# Altium schematic sheet Mouse_Send_SCH.SchDoc
size A3
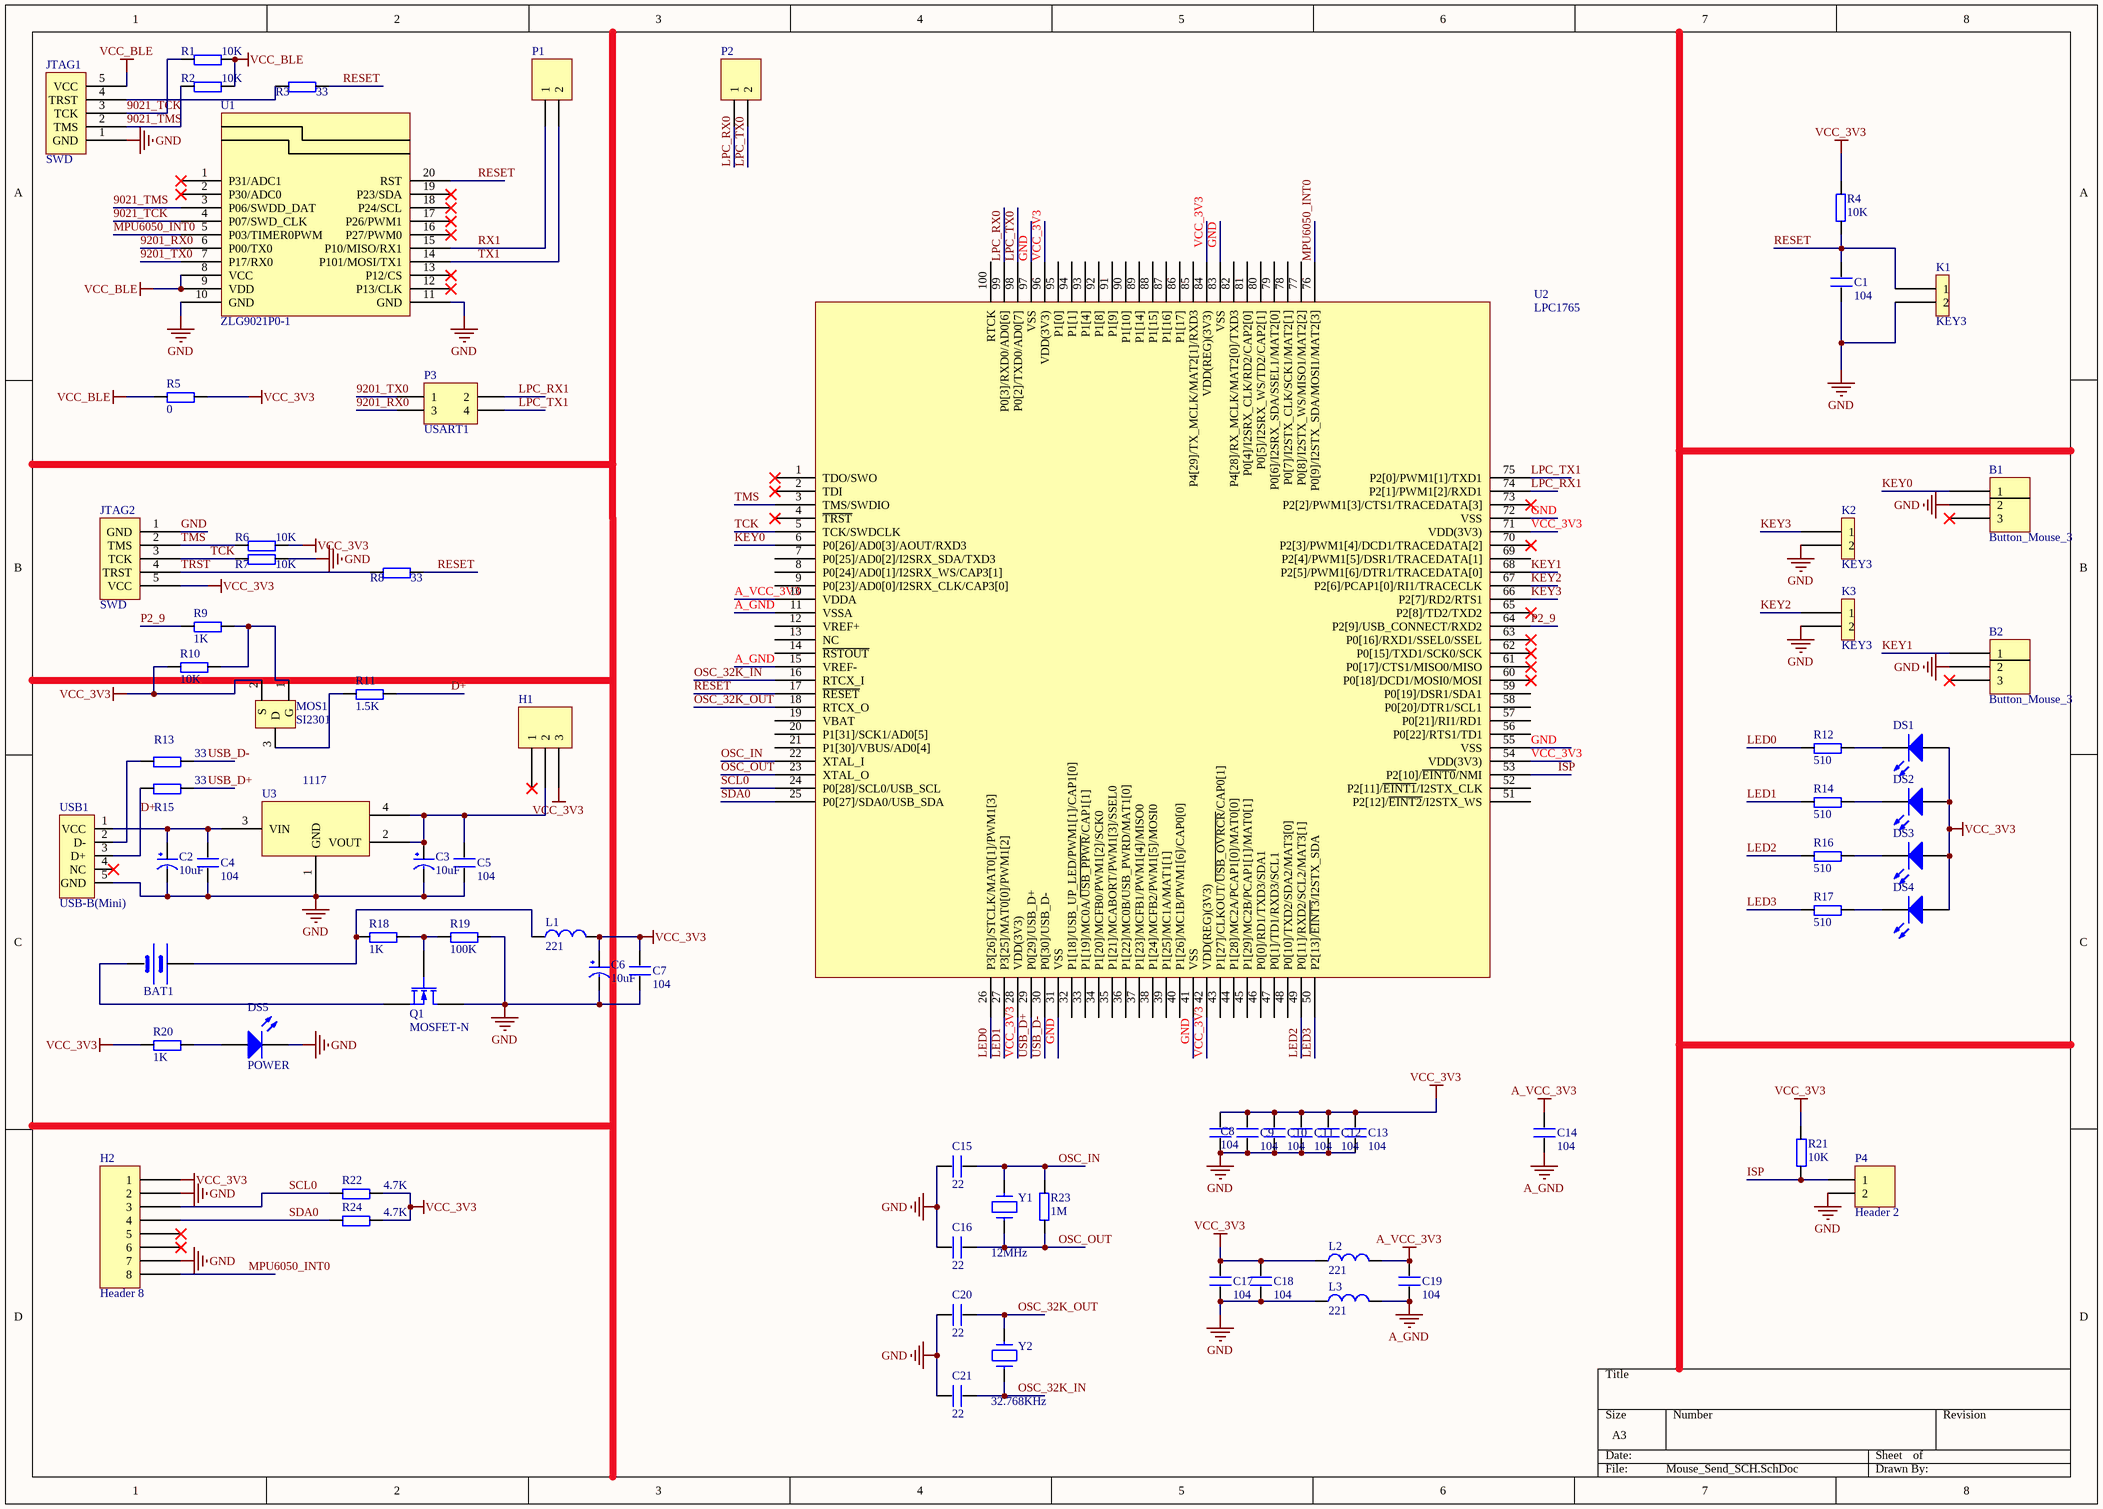
[diagram p0: Mouse_Send_SCH.SchDoc]

## Parts
B1  Button_Mouse_3  [Button_Mouse_3]
B2  Button_Mouse_3  [Button_Mouse_3]
BAT1  BATT  [BAT_NUM5_2]  (value not drawn)
C1  104  [0603P]
C2  10uF  [TAJ_A]
C3  10uF  [TAJ_A]
C4  104  [0603P]
C5  104  [0603P]
C6  10uF  [TAJ_A]
C7  104  [0603P]
C8  104  [0603P]
C9  104  [0603P]
C10  104  [0603P]
C11  104  [0603P]
C12  104  [0603P]
C13  104  [0603P]
C14  104  [0603P]
C15  22  [0603P]
C16  22  [0603P]
C17  104  [0603P]
C18  104  [0603P]
C19  104  [0603P]
C20  22  [0603P]
C21  22  [0603P]
DS1  (no value)  [SMDLED]
DS2  (no value)  [SMDLED]
DS3  (no value)  [SMDLED]
DS4  (no value)  [SMDLED]
DS5  POWER  [SMDLED]
H1  (no value)  [KEY_B]
H2  Header 8  [Header 8]
JTAG1  SWD  [HEAD5]
JTAG2  SWD  [HEAD5]
K1  KEY3  [KEY2]
K2  KEY3  [KEY2]
K3  KEY3  [KEY2]
L1  221  [0603P]
L2  221  [0603P]
L3  221  [0603P]
MOS1  SI2301  [SOT-23]
P1  (no value)  [HDR1X2]
P2  (no value)  [HDR1X2]
P3  USART1  [HDR2X2]
P4  Header 2  [HDR1X2]
Q1  MOSFET-N  [SOT-23]
R1  10K  [0603P]
R2  10K  [0603P]
R3  33  [0603P]
R4  10K  [0603P]
R5  0  [0603P]
R6  10K  [0603P]
R7  10K  [0603P]
R8  33  [0603P]
R9  1K  [0603P]
R10  10K  [0603P]
R11  1.5K  [0603P]
R12  510  [0603P]
R13  33  [0603P]
R14  510  [0603P]
R15  33  [0603P]
R16  510  [0603P]
R17  510  [0603P]
R18  1K  [0603P]
R19  100K  [0603P]
R20  1K  [0603P]
R21  10K  [0603P]
R22  4.7K  [0603P]
R23  1M  [0603P]
R24  4.7K  [0603P]
U1  ZLG9021P0-1  [ZLG9021P0-1]
U2  LPC1765  [TQFP-100]
U3  1117  [AMS1117]
USB1  USB-B(Mini)  [USB/SM0.8-6H5]
Y1  12MHz  [XTAL_US]
Y2  32.768KHz  [CRY-32]

## Nets
A_GND: C14.2 C19.1 L3.2 U2.11(VSSA) U2.15(VREF-)
A_VCC_3V3: C14.1 C19.2 L2.2 U2.10(VDDA)
GND: B1.2 B2.2 C1.1 C2.2(GND) C3.2(GND) C4.1 C5.1 C6.2(GND) C7.1 C8.2 C9.2 C10.2 C11.2 C12.2 C13.2 C15.1 C16.1 C17.1 C18.1 C20.1 C21.1 DS5.2(K) H2.2 H2.7 JTAG1.1(GND) JTAG2.1(GND) K1.2 K2.2 K3.2 L3.1 P4.2 Q1.1(D) R7.2 R19.2 U1.10(GND) U1.11(GND) U2.31(VSS) U2.41(VSS) U2.55(VSS) U2.72(VSS) U2.83(VSS) U2.97(VSS) U3.1(GND) USB1.5(GND)
VCC_3V3: C6.1(VCC) C7.2 C8.1 C9.1 C10.1 C11.1 C12.1 C13.1 C17.2 C18.2 DS1.1(A) DS2.1(A) DS3.1(A) DS4.1(A) H1.3 H2.1 JTAG2.5(VCC) L1.2 L2.1 MOS1.2(S) R4.2 R5.2 R6.2 R10.1 R20.1 R21.2 R22.2 R24.2 U2.28(VDD(3V3)) U2.42(VDD(REG)(3V3)) U2.54(VDD(3V3)) U2.71(VDD(3V3)) U2.84(VDD(REG)(3V3)) U2.96(VDD(3V3))
VCC_BLE: JTAG1.5(VCC) R1.2 R2.2 R5.1 U1.8(VCC) U1.9(VDD)
9021_TCK: JTAG1.3(TCK) R1.1 U1.4(P07/SWD_CLK)
9021_TMS: JTAG1.2(TMS) R2.1 U1.3(P06/SWDD_DAT)
9201_RX0: P3.3 U1.6(P00/TX0)
9201_TX0: P3.1 U1.7(P17/RX0)
D+: R11.2 R15.1 USB1.3(D+)
ISP: P4.1 R21.1 U2.53(P2[10]/~{EINT0}/NMI)
KEY0: B1.1 U2.6(P0[26]/AD0[3]/AOUT/RXD3)
KEY1: B2.1 U2.68(P2[5]/PWM1[6]/DTR1/TRACEDATA[0])
KEY2: K3.1 U2.67(P2[6]/PCAP1[0]/RI1/TRACECLK)
KEY3: K2.1 U2.66(P2[7]/RD2/RTS1)
LED0: R12.1 U2.26(P3[26]/STCLK/MAT0[1]/PWM1[3])
LED1: R14.1 U2.27(P3[25]/MAT0[0]/PWM1[2])
LED2: R16.1 U2.49(P0[11]/RXD2/SCL2/MAT3[1])
LED3: R17.1 U2.50(P2[13]/~{EINT3}/I2STX_SDA)
LPC_RX0: P2.1 U2.99(P0[3]/RXD0/AD0[6])
LPC_RX1: P3.2 U2.74(P2[1]/PWM1[2]/RXD1)
LPC_TX0: P2.2 U2.98(P0[2]/TXD0/AD0[7])
LPC_TX1: P3.4 U2.75(P2[0]/PWM1[1]/TXD1)
MPU6050_INT0: H2.8 U1.5(P03/TIMER0PWM) U2.76(P0[9]/I2STX_SDA/MOSI1/MAT2[3])
OSC_32K_IN: C21.2 U2.16(RTCX_I) Y2.1
OSC_32K_OUT: C20.2 U2.18(RTCX_O) Y2.2
OSC_IN: C15.2 R23.1 U2.22(XTAL_I) Y1.2
OSC_OUT: C16.2 R23.2 U2.23(XTAL_O) Y1.1
P2_9: R9.1 U2.64(P2[9]/USB_CONNECT/RXD2)
RESET: C1.2 K1.1 R3.2 R4.1 R8.2 U1.20(RST) U2.17(~{RESET})
RX1: P1.1 U1.15(P10/MISO/RX1)
SCL0: H2.3 R22.1 U2.24(P0[28]/SCL0/USB_SCL)
SDA0: H2.4 R24.1 U2.25(P0[27]/SDA0/USB_SDA)
TCK: JTAG2.3(TCK) R7.1 U2.5(TCK/SWDCLK)
TMS: JTAG2.2(TMS) R6.1 U2.3(TMS/SWDIO)
TRST: JTAG2.4(TRST) R8.1
TX1: P1.2 U1.14(P101/MOSI/TX1)
USB_D+: R15.2 U2.29(P0[29]/USB_D+)
USB_D-: R13.2 U2.30(P0[30]/USB_D-)
NetBAT1_1: BAT1.1(VCC) L1.1 R18.1
NetBAT1_2: BAT1.2(GND) Q1.3(S)
NetC2_1: C2.1(VCC) C4.2 U3.3(VIN) USB1.1(VCC)
NetC3_1: C3.1(VCC) C5.2 H1.2 U3.2(VOUT) U3.4
NetDS1_2: DS1.2(K) R12.2
NetDS2_2: DS2.2(K) R14.2
NetDS3_2: DS3.2(K) R16.2
NetDS4_2: DS4.2(K) R17.2
NetDS5_1: DS5.1(A) R20.2
NetJTAG1_4: JTAG1.4(TRST) R3.1
NetMOS1_1: MOS1.1(G) R9.2 R10.2
NetMOS1_3: MOS1.3(D) R11.1
NetQ1_2: Q1.2(G) R18.2 R19.1
NetR13_1: R13.1 USB1.2(D-)

Not connected (* = marked no-connect by the designer): B1 3*; B2 3*; H1 1*; H2 5* 6*; U1 1(P31/ADC1)* 2(P30/ADC0)* 12(P13/CLK)* 13(P12/CS)* 16(P27/PWM0)* 17(P26/PWM1)* 18(P24/SCL)* 19(P23/SDA)*; U2 1(TDO/SWO)* 2(TDI)* 4(~{TRST})* 7(P0[25]/AD0[2]/I2SRX_SDA/TXD3) 8(P0[24]/AD0[1]/I2SRX_WS/CAP3[1]) 9(P0[23]/AD0[0]/I2SRX_CLK/CAP3[0]) 12(VREF+) 13(NC) 14(~{RSTOUT}) 19(VBAT) 20(P1[31]/SCK1/AD0[5]) 21(P1[30]/VBUS/AD0[4]) 32(P1[18]/USB_UP_LED/PWM1[1]/CAP1[0]) 33(P1[19]/MC0A/~{USB_PPWR}/CAP1[1]) 34(P1[20]/MCFB0/PWM1[2]/SCK0) 35(P1[21]/MCABORT/PWM1[3]/SSEL0) 36(P1[22]/MC0B/USB_PWRD/MAT1[0]) 37(P1[23]/MCFB1/PWM1[4]/MISO0) 38(P1[24]/MCFB2/PWM1[5]/MOSI0) 39(P1[25]/MC1A/MAT1[1]) 40(P1[26]/MC1B/PWM1[6]/CAP0[0]) 43(P1[27]/CLKOUT/~{USB_OVRCR}/CAP0[1]) 44(P1[28]/MC2A/PCAP1[0]/MAT0[0]) 45(P1[29]/MC2B/PCAP1[1]/MAT0[1]) 46(P0[0]/RD1/TXD3/SDA1) 47(P0[1]/TD1/RXD3/SCL1) 48(P0[10]/TXD2/SDA2/MAT3[0]) 51(P2[12]/~{EINT2}/I2STX_WS) 52(P2[11]/~{EINT1}/I2STX_CLK) 56(P0[22]/RTS1/TD1) 57(P0[21]/RI1/RD1) 58(P0[20]/DTR1/SCL1) 59(P0[19]/DSR1/SDA1) 60(P0[18]/DCD1/MOSI0/MOSI)* 61(P0[17]/CTS1/MISO0/MISO)* 62(P0[15]/TXD1/SCK0/SCK)* 63(P0[16]/RXD1/SSEL0/SSEL)* 65(P2[8]/TD2/TXD2)* 69(P2[4]/PWM1[5]/DSR1/TRACEDATA[1]) 70(P2[3]/PWM1[4]/DCD1/TRACEDATA[2])* 73(P2[2]/PWM1[3]/CTS1/TRACEDATA[3])* 77(P0[8]/I2STX_WS/MISO1/MAT2[2]) 78(P0[7]/I2STX_CLK/SCK1/MAT2[1]) 79(P0[6]/I2SRX_SDA/SSEL1/MAT2[0]) 80(P0[5]/I2SRX_WS/TD2/CAP2[1]) 81(P0[4]/I2SRX_CLK/RD2/CAP2[0]) 82(P4[28]/RX_MCLK/MAT2[0]/TXD3) 85(P4[29]/TX_MCLK/MAT2[1]/RXD3) 86(P1[17]) 87(P1[16]) 88(P1[15]) 89(P1[14]) 90(P1[10]) 91(P1[9]) 92(P1[8]) 93(P1[4]) 94(P1[1]) 95(P1[0]) 100(RTCK); USB1 4(NC)*

## Library data of the parts
BAT1 = BAT
C1 C4 C5 C7-C21 = C
C2 C3 C6 = CAP
DS1-DS5 = LED2: Typical RED, GREEN, YELLOW, AMBER GaAs LED; Published: 8-Jun-2000; LatestRevisionDate: 17-Jul-2002; LatestRevisionNote: Re-released for DXP Platform.; PackageDocument: Feb-2002; PackageReference: 3.2X1.6X1.1; Publisher: Altium Limited
H1 = Header 3
L1-L3 = Inductor: Value: 221
MOS1 = MOS-P: IRLML6401/SI2301
P1 P2 = Header 2: LatestRevisionDate: 17-Jul-2002; LatestRevisionNote: Re-released for DXP Platform.; Publisher: Altium Limited
P3 = Header 2X2: Header, 2-Pin, Dual row; LatestRevisionDate: 17-Jul-2002; LatestRevisionNote: Re-released for DXP Platform.; Publisher: Altium Limited
Q1 = MOSFET-N: N-Channel MOSFET; Published: 8-Jun-2000; LatestRevisionDate: 17-Jul-2002; LatestRevisionNote: Re-released for DXP Platform.; PackageVersion: 1995/1996; PackageReference: E3; Publisher: Altium Limited; PackageDescription: TO, Flat Index; 3 In-Line, Axial Leads; Body Dia. 4.6mm; Lead Dia. 0.5 mm (max)
R1-R24 = R
USB1 = USB5
Y1 Y2 = CRYSTAL
P4 = Header 2: LatestRevisionDate: 17-Jul-2002; LatestRevisionNote: Re-released for DXP Platform.; Publisher: Altium Limited